# Altium schematic sheet [05] - Analog signal.SchDoc
size A
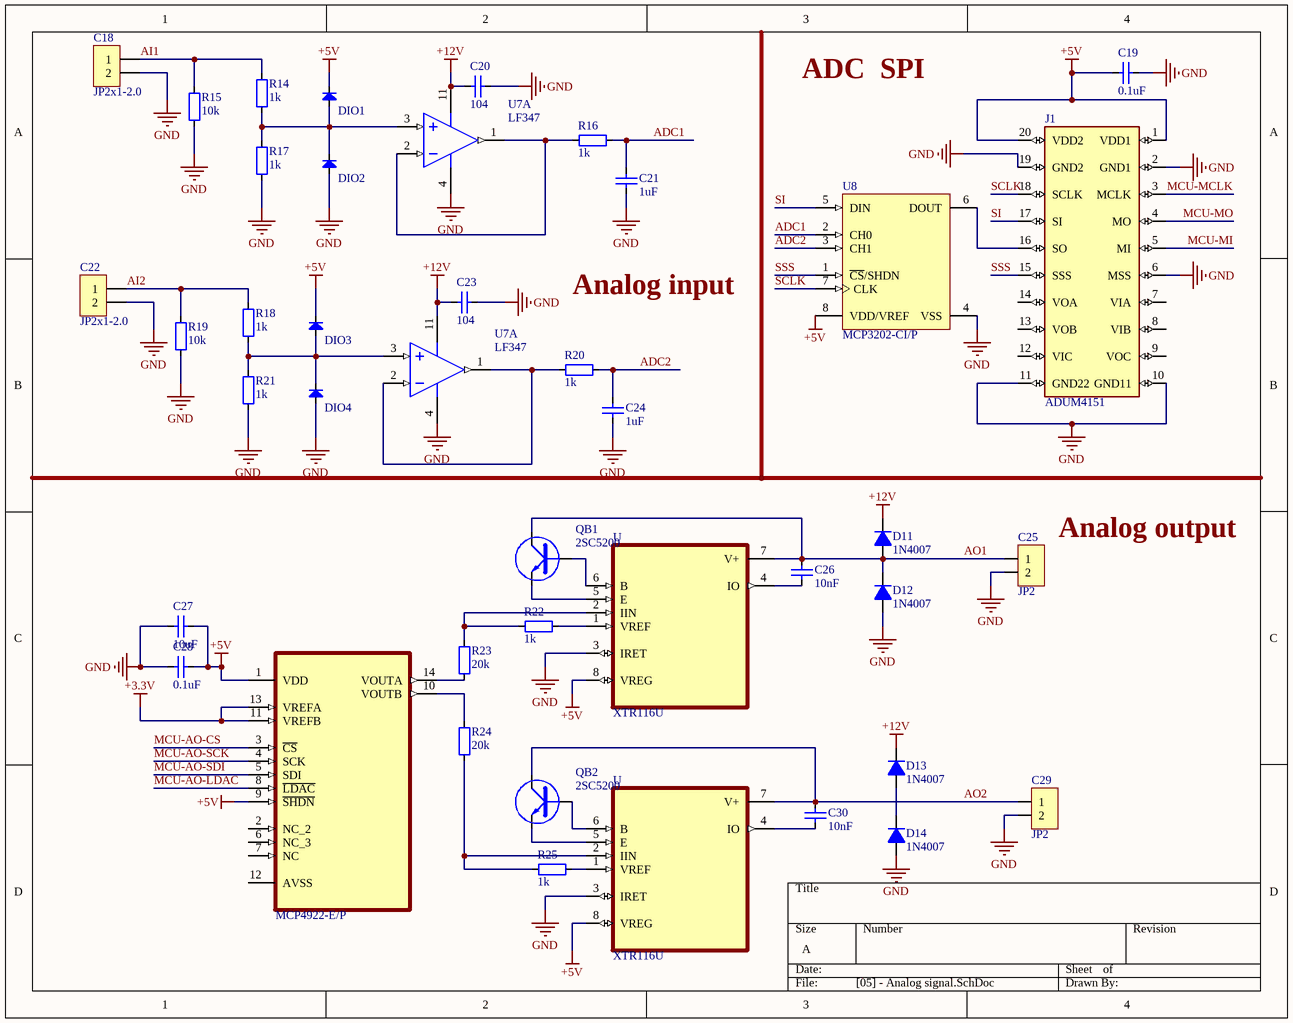
[diagram p0: [05] - Analog signal.SchDoc]

## Parts
(Parts that share a designator on the sheet are numbered #1, #2 ... from top to bottom, then left to right.)
?  MCP4922-E/P  [DIP254P762X533-14]
C18  JP2x1-2.0  [J2-C1T]
C19  0.1uF  [CAP_0402]
C20  104  [CAP_0402]
C21  1uF  [CAP_0402]
C22  JP2x1-2.0  [J2-C1T]
C23  104  [CAP_0402]
C24  1uF  [CAP_0402]
C25  JP2  [JP2-C1T]
C26  10nF  [CAP_0402]
C27  10uF  [CAP_0402]
C28  0.1uF  [CAP_0402]
C29  JP2  [JP2-C1T]
C30  10nF  [CAP_0402]
D11  1N4007  [D1A]
D12  1N4007  [D1A]
D13  1N4007  [D1A]
D14  1N4007  [D1A]
DIO1  Diode SMD  [DO-214AB(SMC)]  (value not drawn)
DIO2  Diode SMD  [DO-214AB(SMC)]  (value not drawn)
DIO3  Diode SMD  [DO-214AB(SMC)]  (value not drawn)
DIO4  Diode SMD  [DO-214AB(SMC)]  (value not drawn)
J1  ADUM4151  [SOIC20R]
QB1  2SC5200  [2SC5200]
QB2  2SC5200  [2SC5200]
R14  1k  [RES-SMD-0101]
R15  10k  [RES-SMD-0101]
R16  1k  [RES-SMD-0101]
R17  1k  [RES-SMD-0101]
R18  1k  [RES-SMD-0101]
R19  10k  [RES-SMD-0101]
R20  1k  [RES-SMD-0101]
R21  1k  [RES-SMD-0101]
R22  1k  [RES-SMD-0101]
R23  20k  [RES-SMD-0805]
R24  20k  [RES-SMD-0805]
R25  1k  [RES-SMD-0101]
U7#1  LF347  [SO14]  (part A of 4)
U7#2  LF347  [SO14]  (part A of 4)
U8  MCP3202-CI/P  [PDIP300-P8]
U#1  XTR116U  [SOIC127P599X175-8N]
U#2  XTR116U  [SOIC127P599X175-8N]

## Nets
+3.3V: ?.11(VREFB) ?.13(VREFA)
+5V: ?.1(VDD) ?.9(~{SHDN}) C19.1 C27.2 C28.2 DIO1.2(K) DIO3.2(K) J1.1(VDD1) J1.20(VDD2) U8.8(VDD/VREF) U#1.8(VREG) U#2.8(VREG)
+12V: C20.1 C23.1 D11.2(K) D13.2(K) U7#1.11(VEE) U7#2.11(VEE)
GND: C18.2 C19.2 C20.2 C21.1 C22.2 C23.2 C24.1 C25.2 C27.1 C28.1 C29.2 D12.1(A) D14.1(A) DIO2.1(A) DIO4.1(A) J1.2(GND1) J1.6(MSS) J1.10(GND11) J1.11(GND22) J1.19(GND2) R15.1 R17.1 R19.1 R21.1 U7#1.4(VCC) U7#2.4(VCC) U8.4(VSS) U#1.3(IRET) U#2.3(IRET)
ADC1: C21.2 R16.1 U8.2(CH0)
ADC2: C24.2 R20.1 U8.3(CH1)
AI1: C18.1 R14.2 R15.2
AI2: C22.1 R18.2 R19.2
AO1: C25.1 C26.2 D11.1(A) D12.2(K) QB1.2(C) U#1.7(V+)
AO2: C29.1 C30.2 QB2.2(C) U#2.7(V+)
MCU-AO-CS: ?.3(~{CS})
MCU-AO-LDAC: ?.8(~{LDAC})
MCU-AO-SCK: ?.4(SCK)
MCU-AO-SDI: ?.5(SDI)
MCU-MCLK: J1.3(MCLK)
MCU-MI: J1.5(MI)
MCU-MO: J1.4(MO)
SCLK: J1.18(SCLK) U8.7(CLK)
SI: J1.17(SI) U8.5(DIN)
SSS: J1.15(SSS) U8.1(~{CS}/SHDN)
Net?_10: ?.10(VOUTB) R24.2
Net?_14: ?.14(VOUTA) R23.1
NetC26_1: C26.1 U#1.4(IO)
NetC30_1: C30.1 U#2.4(IO)
NetD13_1: D13.1(A) D14.2(K)
NetDIO1_1: DIO1.1(A) DIO2.2(K) R14.1 R17.2 U7#1.3(1_IN+)
NetDIO3_1: DIO3.1(A) DIO4.2(K) R18.1 R21.2 U7#2.3(1_IN+)
NetJ1_16: J1.16(SO) U8.6(DOUT)
NetQB1_1: QB1.1(B) U#1.6(B)
NetQB1_3: QB1.3(E) U#1.5(E)
NetQB2_1: QB2.1(B) U#2.6(B)
NetQB2_3: QB2.3(E) U#2.5(E)
NetR16_2: R16.2 U7#1.1(1_OUT) U7#1.2(1_IN-)
NetR20_2: R20.2 U7#2.1(1_OUT) U7#2.2(1_IN-)
NetR22_1: R22.1 R23.2 U#1.2(IIN)
NetR22_2: R22.2 U#1.1(VREF)
NetR24_1: R24.1 R25.1 U#2.2(IIN)
NetR25_2: R25.2 U#2.1(VREF)

Not connected (* = marked no-connect by the designer): ? 2(NC_2) 6(NC_3) 7(NC) 12(AVSS); J1 7(VIA) 8(VIB) 9(VOC) 12(VIC) 13(VOB) 14(VOA)

## Notes on the sheet
- Labels drawn without touching a wire or pin: ADC  SPI, Analog input, Analog output

## Library data of the parts
? = MCP4922-E/P: 12 Bit Digital to Analog Converter 2 14-PDIP; MF: Microchip; Price: None; Availability: Unavailable; SnapEDA_Link: https://www.snapeda.com/parts/MCP4922-E/P/Microchip/view-part/43393/?ref=snap; MP: MCP4922-E/P; Value: *; Package: DIP-14 Microchip
C18 C22 = JP2x1-2.0: WR-PHD 2.00 mm Socket Header; Manufacturer: W¨¹rth Elektronik eiSos GmbH; partNo: 62000211821; ComponentLink1 Description: Manufacturer; ComponentLink2 Description: Datasheet; NoPins: 02; Created Date: 2 April 2013; ComponentLink1URL: http://www.we-online.com; ComponentLink2URL: http://katalog.we-online.de/em/datasheet/6200xx11821.pdf; Created by: Karrer Zheng
C19-C21 C23 C24 C26-C28 C30 = CapSMD: Capacitor; Value: 33p; Published: 8-Jun-2000; LatestRevisionDate: 17-Jul-2002; LatestRevisionNote: Re-released for DXP Platform.; PackageReference: RAD-0.3; Publisher: Altium Limited
C25 C29 = JP2: WR-PHD 2.54 mm Angled Socket Header; Manufacturer: W¨¹rth Elektronik eiSos GmbH; partNo: 613002143121; ComponentLink1 Description: Manufacturer; ComponentLink2 Description: Datasheet; NoPins: 02; Created Date: 29 March 2013; ComponentLink1URL: http://www.we-online.com; ComponentLink2URL: http://katalog.we-online.de/em/datasheet/6130xx143121.pdf; Created by: Karrer Zheng
D11-D14 = D1A: Diode 1A; Value: 1N4007
DIO1-DIO4 = Diode SMD: Default Diode; Code - JEDEC: DO-214-AB; Value: 1N5007; Published: 8-Jun-2000; Revision: July-2002: Re-released for DXP Platform.; Publisher: Altium Limited
J1 = ADUM4151: ADI 7 Ch, Isolator for SPI Interface; MF: Analog Devices; Price: None; SnapEDA_Link: https://www.snapeda.com/parts/ADUM4151/Analog%20Devices/view-part/5010508/?ref=snap; Availability: Bad; Value: *; MP: ADUM4151; Package: None; Check_prices: https://www.snapeda.com/parts/ADUM4151/Analog%20Devices/view-part/5010508/?ref=eda
QB1 QB2 = 2SC5200: Transistor Power Supply; Value: D718
R14-R25 = Resistor - SMD: Resistor; Manufacturer: Generic Components; Class: Passive; Published: 08/06/2000; Publisher: Altium Hobart Technology Centre
U7#1 U7#2 = LF347: Low Power Quad Operational Amplifier; Manufacturer Part Number: LF347BD; Manufacturer: Texas Instruments; Text Field1: pristel=Nsc\nsanopea\<parttype>.ckt; Slew Rate: 13 V/µs; Voltage - Supply, Single/Dual (±): 7 V ~ 36 V, ±3.5 V ~ 18 V; Current - Input Bias: 50pA; Voltage - Input Offset: 3000µV; Number of Circuits: 4; Gain Bandwidth Product: 3MHz; Amplifier Type: J-FET; Current - Supply: 8mA; Supplier 1: Digi-Key; Supplier Part Number 1: 296-7136-5-ND; Package / Case: 14-SOIC (3.9mm Width), 14-SOL; Supplier: Digi-Key; Current - Output / Channel: -; Packaging: Tube; RoHS: RoHS Compliant; Output Type: -; Operating Temperature: 0°C ~ 70°C; Category: Integrated Circuits (ICs); Supplier Part Number: 296-7136-5-ND
U8 = MCP3202-CI/P: 2.7V Dual Channel 12-Bit A/D Converter with SPI Serial Interface, 8-Pin PDIP, C Performance Grade, Industrial Temperature; Code_JEDEC: MS-001; PackageVersion: revBB, Aug-2009; PackageReference: PDIP300-P8; PackageDescription: 8-Lead Plastic Dual In-Line (P) - 300 mil Body [PDIP]; DatasheetVersion: revE, Dec-2008; PartNumber: MCP3202-CI/P
U#1 U#2 = XTR116U: 4-20mA Current Loop Transmitter with 4.096-V reference and 200-?A power 8-SOIC -40 to 85; MF: Texas Instruments; Package: SOIC-8 Texas Instruments; DigiKey-Purchase-URL: https://snapeda.com/shop?store=DigiKey&id=485469; MP: XTR116U; Value: *; Price: None; Texas_Instruments-Purchase-URL: https://snapeda.com/shop?store=Texas+Instruments&id=485469; Availability: Warning; SnapEDA_Link: https://www.snapeda.com/parts/XTR116U/Texas%20Instruments/view-part/485469/?ref=snap; Mouser-Purchase-URL: https://snapeda.com/shop?store=Mouser&id=485469
  U#2: BuyPart: https://www.snapeda.com/parts/XTR116U/Texas%20Instruments/view-part/485469/?ref=eda